# EAGLE design 6540Adapter_smt (EAGLE 7.6.0)
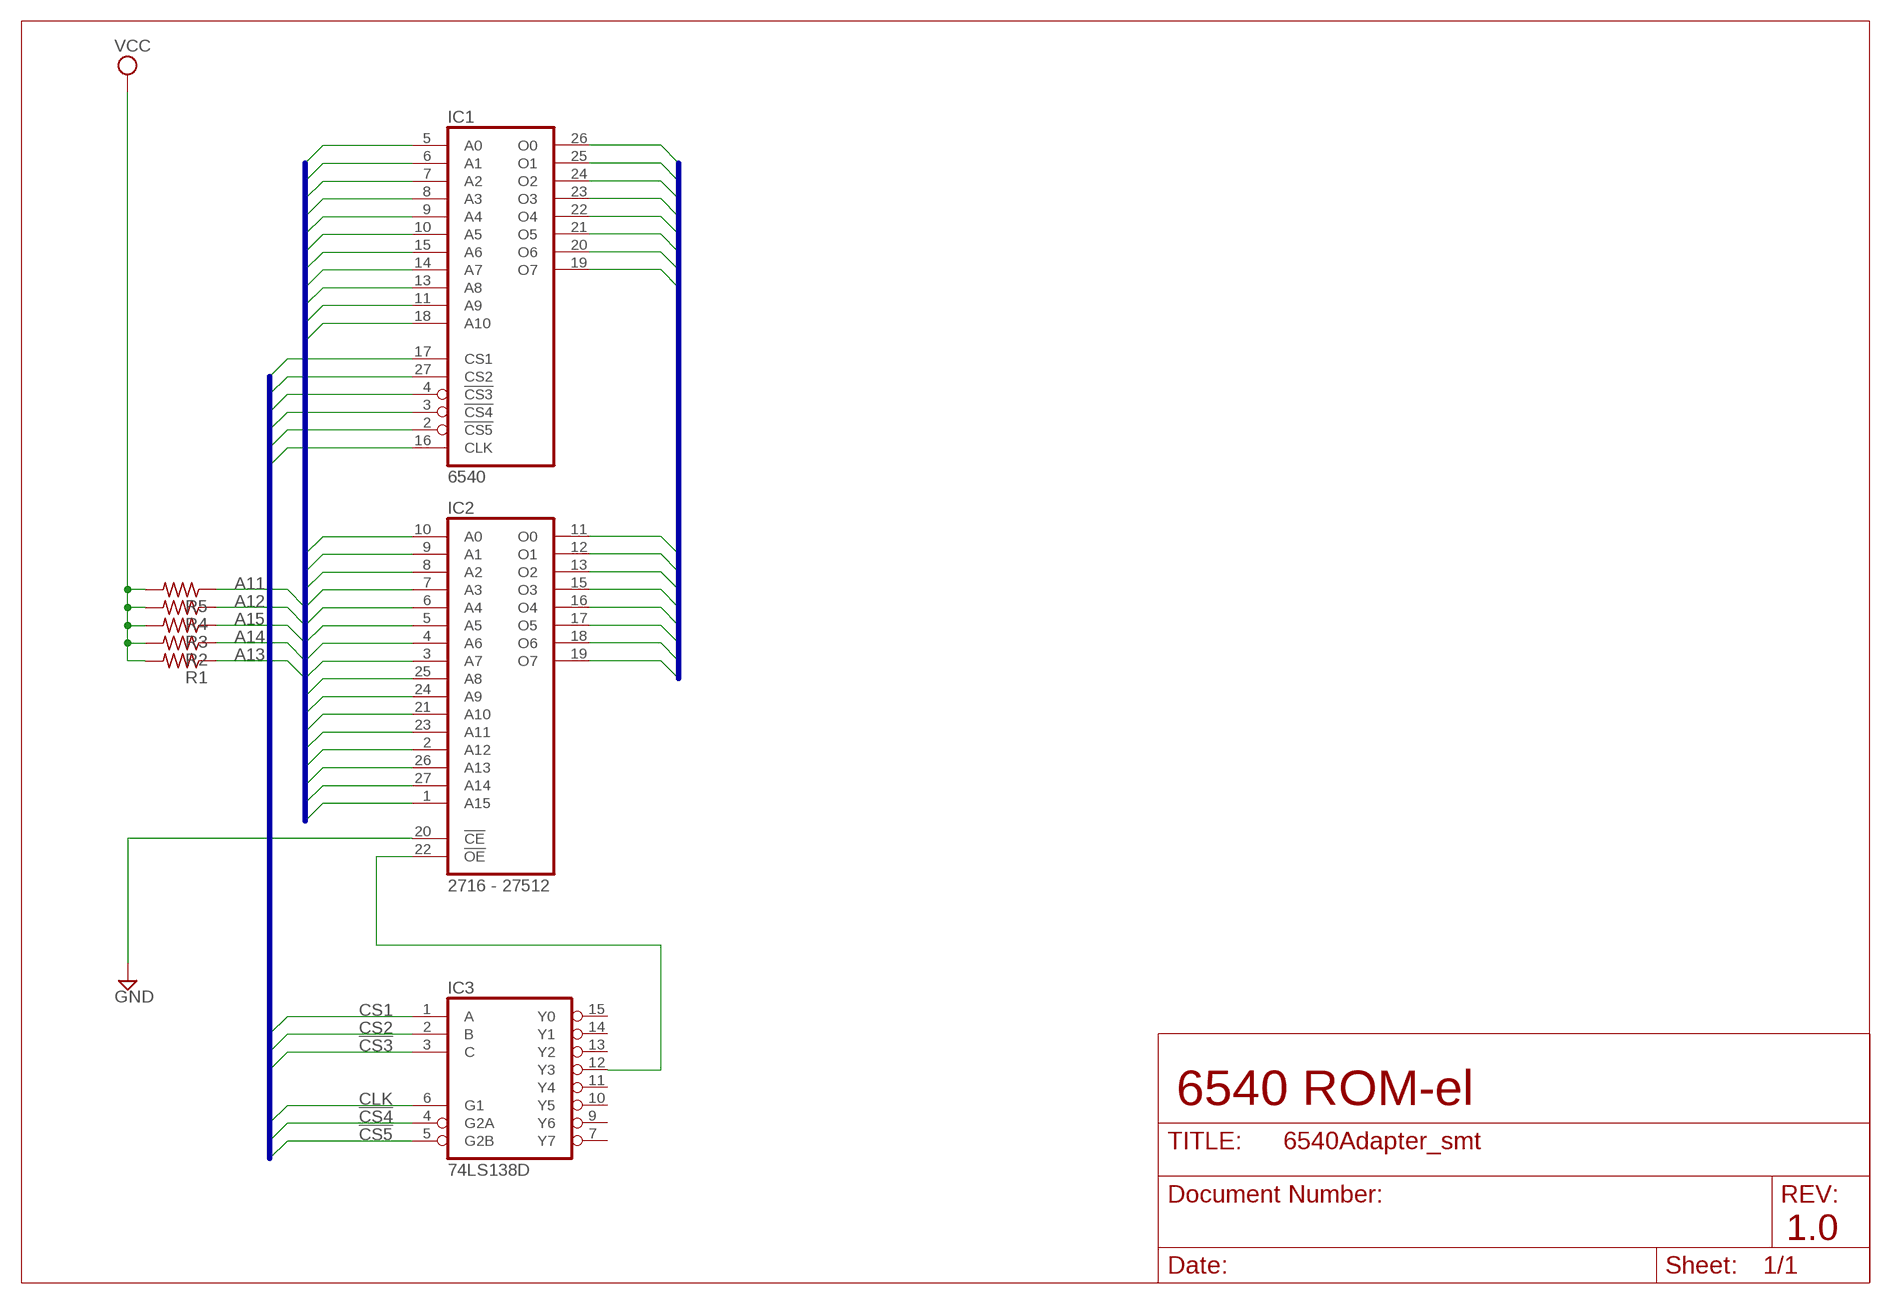
[diagram p0: schematic, sheet 1]

## Parts
IC1  6540  6540-RP  [DIL28-ROUNDPAD]
IC2  2716 - 27512  27512-NR  [DIL28-ROUNDPAD]
IC3  74LS138D  [SO16]
R1  R-US_R0805  [R0805]
R2  R-US_R0805  [R0805]
R3  R-US_R0805  [R0805]
R4  R-US_R0805  [R0805]
R5  R-US_R0805  [R0805]

## Nets
!CS3: IC1.4(!CS3) IC3.3(C)
!CS4: IC1.3(!CS4) IC3.4(G2A)
!CS5: IC1.2(!CS5) IC3.5(G2B)
A0: IC1.5(A0) IC2.10(A0)
A1: IC1.6(A1) IC2.9(A1)
A2: IC1.7(A2) IC2.8(A2)
A3: IC1.8(A3) IC2.7(A3)
A4: IC1.9(A4) IC2.6(A4)
A5: IC1.10(A5) IC2.5(A5)
A6: IC1.15(A6) IC2.4(A6)
A7: IC1.14(A7) IC2.3(A7)
A8: IC1.13(A8) IC2.25(A8)
A9: IC1.11(A9) IC2.24(A9)
A10: IC1.18(A10) IC2.21(A10)
A11: IC2.23(A11) R5.1
A12: IC2.2(A12) R4.1
A13: IC2.26(A13) R1.1
A14: IC2.27(A14) R2.1
A15: IC2.1(A15) R3.1
CLK: IC1.16(CLK) IC3.6(G1)
CS1: IC1.17(CS1) IC3.1(A)
CS2: IC1.27(CS2) IC3.2(B)
D0: IC1.26(O0) IC2.11(O0)
D1: IC1.25(O1) IC2.12(O1)
D2: IC1.24(O2) IC2.13(O2)
D3: IC1.23(O3) IC2.15(O3)
D4: IC1.22(O4) IC2.16(O4)
D5: IC1.21(O5) IC2.17(O5)
D6: IC1.20(O6) IC2.18(O6)
D7: IC1.19(O7) IC2.19(O7)
GND: IC2.20(!CE)
N$1: IC2.22(!OE) IC3.12(Y3)
VCC: R1.2 R2.2 R3.2 R4.2 R5.2
Unconnected: IC3.7(Y7) IC3.9(Y6) IC3.10(Y5) IC3.11(Y4) IC3.13(Y2) IC3.14(Y1) IC3.15(Y0)

## Buses
A[0..15]
D[0..7]
CS1,CS2,!CS3,!CS4,!CS5,CLK

## Notes on the sheet
- 6540 ROM-el
- 1.0

## Power pins joined to a net without a drawn wire
GND: IC1.1(GND) IC2.14(GND) IC3.8(GND)
VCC: IC1.12(VCC) IC2.28(VCC) IC3.16(VCC)

## Library data of the parts
IC1 = commodore:6540
IC2 = 0RB_Memory:27512
IC3 = 74xx-us:74*138: 3-line to 8-line DECODER/DEMULTIPLEXER
R1-R5 = resistor:R-US_: RESISTOR, American symbol

## Board
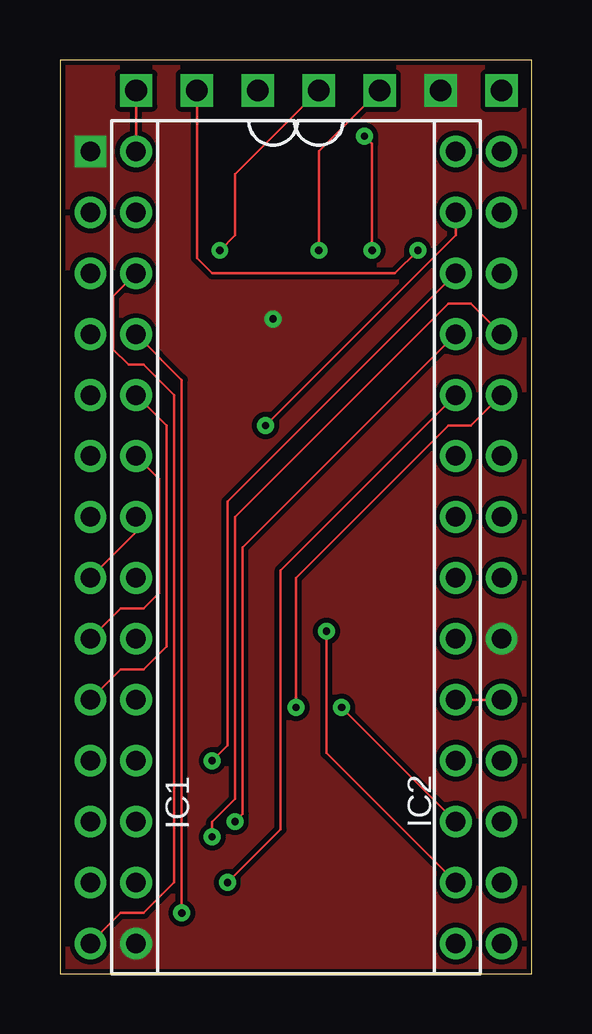
[diagram p1: board, top side]
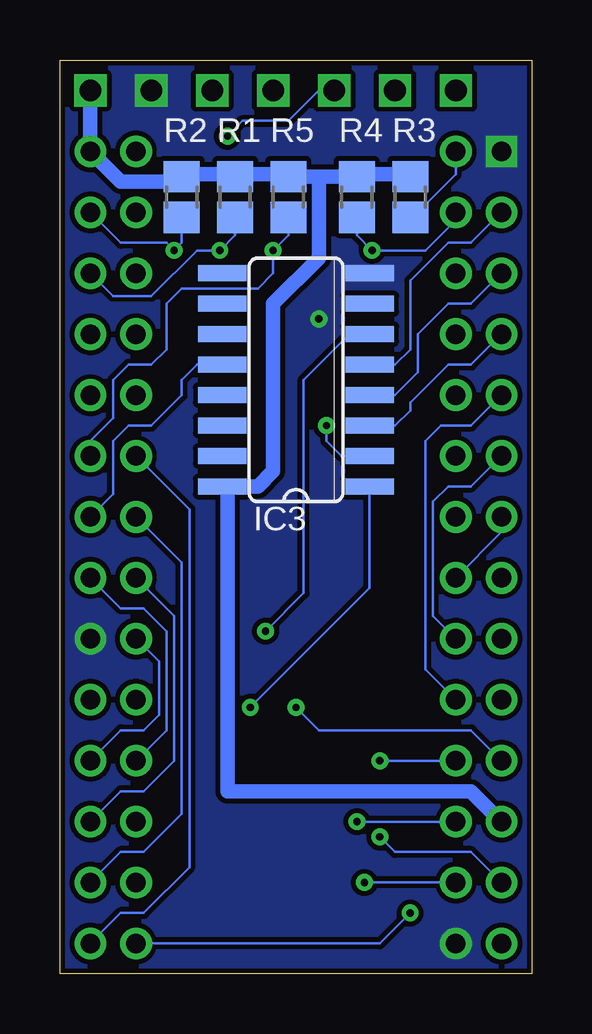
[diagram p2: board, bottom side, seen from below]

Size 19.68 x 38.1 mm. Coordinates in mm from the lower left corner, seen from the top.
Outline: 0,0 19.68,0 19.68,38.1 0,38.09 0,0
Copper layers (1*16): Top 0.035mm / dielectric 1.5mm / Bottom 0.035mm
Design rules "default *": minimum track width 4mil, minimum drill 10mil, track to track 8mil, track to pad 8mil, pad to pad 8mil, via to via 8mil, smd to smd 8mil, copper to edge 8mil, drill to drill 8mil, minimum pad ring 10mil, minimum via ring 8mil, stop-mask expansion 4mil, vias tented up to drill 0mil, thermal gap 10mil

### Footprints (pad centres in the part's own frame; a part is rotated, then mirrored left to right if it is on the bottom)
DIL28-ROUNDPAD = drill 0.813 square: 1 -16.51,-7.62 | drill 0.813: 2 -13.97,-7.62; 3 -11.43,-7.62; 4 -8.89,-7.62; 5 -6.35,-7.62; 6 -3.81,-7.62; 7 -1.27,-7.62; 8 1.27,-7.62; 9 3.81,-7.62; 10 6.35,-7.62; 11 8.89,-7.62; 12 11.43,-7.62; 13 13.97,-7.62; 14 16.51,-7.62; 15 16.51,7.62; 16 13.97,7.62; 17 11.43,7.62; 18 8.89,7.62; 19 6.35,7.62; 20 3.81,7.62; 21 1.27,7.62; 22 -1.27,7.62; 23 -3.81,7.62; 24 -6.35,7.62; 25 -8.89,7.62; 26 -11.43,7.62; 27 -13.97,7.62; 28 -16.51,7.62
DIL28-ROUNDPAD' = drill 0.813: 1 -16.51,-7.62; 2 -13.97,-7.62; 3 -11.43,-7.62; 4 -8.89,-7.62; 5 -6.35,-7.62; 6 -3.81,-7.62; 7 -1.27,-7.62; 8 1.27,-7.62; 9 3.81,-7.62; 10 6.35,-7.62; 11 8.89,-7.62; 12 11.43,-7.62; 13 13.97,-7.62; 14 16.51,-7.62; 15 16.51,7.62; 16 13.97,7.62; 17 11.43,7.62; 18 8.89,7.62; 19 6.35,7.62; 20 3.81,7.62; 21 1.27,7.62; 22 -1.27,7.62; 23 -3.81,7.62; 24 -6.35,7.62; 25 -8.89,7.62; 26 -11.43,7.62; 27 -13.97,7.62; 28 -16.51,7.62
SO16 = smd 0.66 x 2.032: 1 -4.445,-3.073; 2 -3.175,-3.073; 3 -1.905,-3.073; 4 -0.635,-3.073; 5 0.635,-3.073; 6 1.905,-3.073; 7 3.175,-3.073; 8 4.445,-3.073; 9 4.445,3.073; 10 3.175,3.073; 11 1.905,3.073; 12 0.635,3.073; 13 -0.635,3.073; 14 -1.905,3.073; 15 -3.175,3.073; 16 -4.445,3.073
R0805 = smd 1.3 x 1.5: 1 -0.85,0; 2 0.85,0

### Placement (x,y rotation side)
IC1  8.89,17.78 270 top
IC2  2716 - 27512  [DIL28-ROUNDPAD']  10.79,17.78 270 top
IC3  9.84,24.77 90 bottom
R1  12.38,32.38 90 bottom
R2  14.61,32.38 90 bottom
R3  5.08,32.38 90 bottom
R4  7.3,32.38 90 bottom
R5  10.16,32.38 90 bottom

### Tracks (layer width: path | path; a pad name or v marks a point on that pad's centre or on a via)
!CS3
  Bottom 0.102: IC1.4 2.54,25.4 3.49,25.4 5.08,23.81 5.08,23.5 5.71,22.86 IC3.3
!CS4
  Bottom 0.102: IC1.3 2.54,27.94 3.49,27.94 4.76,26.67 4.76,25.08 5.71,24.13 IC3.4
!CS5
  Bottom 0.102: IC1.2 2.54,30.48 3.49,30.48 5.08,28.89 5.08,26.04 5.71,25.4 IC3.5
A0
  Bottom 0.102: IC2.10 4.45,12.7 4.45,22.23 3.81,22.86 2.54,22.86 IC1.5
A1
  Bottom 0.102: IC2.9 4.13,14.92 4.13,19.68 3.49,20.32 2.54,20.32 IC1.6
A2
  Bottom 0.102: IC1.7 1.27,18.41 IC2.8
A3
  Top 0.102: IC2.7 3.17,18.41 IC1.8
A4
  Top 0.102: IC2.6 4.13,20.64 4.13,15.88 3.49,15.24 2.54,15.24 IC1.9
A5
  Top 0.102: IC2.5 4.45,22.86 4.45,13.65 3.49,12.7 2.54,12.7 IC1.10
A6  (via drill 0.3)
  Top 0.102: IC2.4 5.08,24.77 v5.08,2.54
  Bottom 0.102: v5.08,2.54 6.35,1.27 IC1.15
A7
  Top 0.102: IC2.3 2.22,28.26 2.22,26.04 2.86,25.4 3.49,25.4 4.76,24.13 4.76,3.81 3.49,2.54 2.54,2.54 IC1.14
A8  (via drill 0.3)
  Top 0.102: IC2.25 17.14,27.94 16.19,27.94 7.3,19.05 7.3,7.3 6.35,6.35 v6.35,5.71
  Bottom 0.102: IC1.13 2.54,5.08 5.71,5.08 v6.35,5.71
A9  (via drill 0.3)
  Top 0.102: IC2.24 17.14,22.86 16.19,22.86 9.84,16.51 v9.84,11.11
  Bottom 0.102: IC1.11 2.54,10.16 8.89,10.16 v9.84,11.11
A10
  Bottom 0.102: IC1.18 15.24,10.16 15.24,14.29 16.19,15.24 17.14,15.24 IC2.21
A11  (via drill 0.3, 0.9)
  Top 0.102: v13.34,36.83 10.79,34.29 v10.79,30.16
  Bottom 0.102: R5.1 10.16,30.8 v10.79,30.16 10.79,29.21 11.43,28.57 14.61,28.57 15.24,27.94 15.24,26.04 15.88,25.4 16.83,25.4 17.46,24.77 17.46,23.18 18.41,22.23 IC2.23
A12  (via drill 0.3, 0.9)
  Top 0.102: v10.79,36.83 7.3,33.34 7.3,30.8 v6.67,30.16
  Bottom 0.102: IC2.2 3.17,31.43 4.45,30.16 v6.67,30.16 7.3,30.8 R4.1
A13  (via drill 0.3, 0.9)
  Top 0.102: v13.02,30.16 13.02,34.61 v12.7,34.92
  Bottom 0.102: IC2.26 17.46,28.26 15.88,28.26 13.97,30.16 v13.02,30.16 12.38,30.8 R1.1 | v12.7,34.92 12.06,35.56 10.16,35.56 8.89,36.83 v8.26,36.83
A14  (via drill 0.3, 0.9)
  Top 0.102: v14.92,30.16 13.97,29.21 6.35,29.21 5.71,29.84 v5.71,36.83
  Bottom 0.102: R2.1 14.61,30.48 v14.92,30.16 15.24,30.48 17.14,30.48 IC2.27
A15  (via drill 0.9)
  Top 0.102: IC2.1 v3.17,36.83
  Bottom 0.102: R3.1 4.98,31.54 3.17,33.34 IC2.1
CLK  (via drill 0.3)
  Top 0.102: v11.11,14.29 11.11,9.21 IC1.16
  Bottom 0.102: IC3.6 7.62,26.67 9.53,24.77 9.53,15.88 v11.11,14.29
CS1  (via drill 0.3)
  Top 0.102: IC1.17 v11.75,11.11
  Bottom 0.102: IC3.1 6.77,16.09 v11.75,11.11
CS2  (via drill 0.3)
  Top 0.102: IC1.27 16.51,30.8 v8.57,22.86
  Bottom 0.102: v8.57,22.86 8.57,22.23 7.94,21.59 IC3.2
D0  (via drill 0.3)
  Top 0.102: v6.35,8.89 6.99,9.53 6.99,19.68 IC1.26
  Bottom 0.102: IC2.11 v6.35,8.89
D1  (via drill 0.3)
  Top 0.102: IC1.25 7.62,17.78 7.62,6.67 v7.3,6.35
  Bottom 0.102: IC2.12 v7.3,6.35
D2  (via drill 0.3)
  Top 0.102: IC1.24 9.21,16.83 9.21,6.03 v6.99,3.81
  Bottom 0.102: IC2.13 v6.99,3.81
D3
  Bottom 0.102: IC1.23 14.29,19.37 14.29,4.45 16.19,2.54 17.14,2.54 IC2.15
D4
  Bottom 0.102: IC1.22 14.61,17.14 14.61,6.67 16.19,5.08 17.14,5.08 IC2.16
D5
  Bottom 0.102: IC1.21 14.92,14.92 14.92,8.89 16.19,7.62 17.14,7.62 IC2.17
D6
  Bottom 0.102: IC1.20 15.56,13.02 15.56,10.79 16.19,10.16 17.14,10.16 IC2.18
D7
  Top 0.102: IC1.19 IC2.19
GND  (via drill 0.3, 0.9)
  other vias: 15.88,36.83 8.89,27.3
  pour Top (no thermals): 0,38.1 19.68,38.1 19.68,0 0,0
  pour Bottom (no thermals): 0,38.1 19.68,38.1 19.68,0 0,0
N$1
  Bottom 0.102: IC3.12 13.97,25.4 14.61,24.77 14.61,24.13 15.88,22.86 16.83,22.86 17.46,22.23 17.46,20 IC2.22
VCC  (via drill 0.9)
  Bottom 0.102: 14.39,33.34 R1.2 14.29,33.34 | 12.17,33.34 R2.2 12.06,33.34 | R5.2 9.95,33.34 | R4.2 7.62,33.34 | 5.5,33.34 R3.2
  Bottom 0.61: 14.39,33.34 14.61,33.02 17.14,33.02 IC2.28 v18.41,36.83 | 12.17,33.34 14.29,33.34 | 9.95,33.34 12.06,33.34 | 8.89,33.23 R4.2 | 8.89,33.23 R5.2 | 7.62,33.34 5.5,33.34 | 12.7,20.32 IC3.16 | 12.7,20.32 11.43,20.32 10.79,20.95 10.79,27.94 8.89,29.84 8.89,33.23 | IC1.12 2.54,7.62 12.7,7.62 12.7,20.32

### Text on the board
tValues: A15 | A14 | A13 | A12 | A11 | GND | VCC | ROM-el | 6540